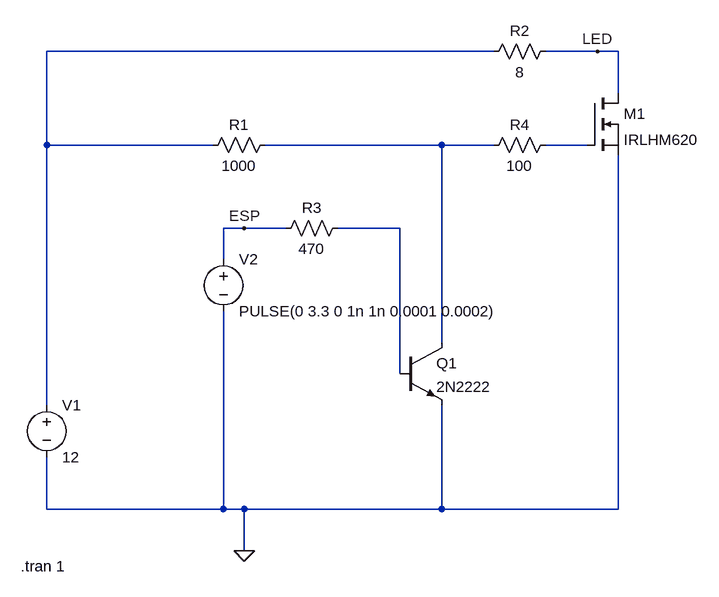
[diagram p0: schematic Draft1.asc]
Draft1.asc, the LTspice schematic file:
Version 4.1
SHEET 1 1384 680
WIRE 1056 -768 368 -768
WIRE 1216 -768 1136 -768
WIRE 1248 -768 1216 -768
WIRE 1248 -704 1248 -768
WIRE 368 -624 368 -768
WIRE 624 -624 368 -624
WIRE 976 -624 704 -624
WIRE 1056 -624 976 -624
WIRE 1200 -624 1136 -624
WIRE 672 -496 640 -496
WIRE 736 -496 672 -496
WIRE 912 -496 816 -496
WIRE 640 -448 640 -496
WIRE 976 -320 976 -624
WIRE 912 -272 912 -496
WIRE 368 -224 368 -624
WIRE 368 -64 368 -144
WIRE 640 -64 640 -368
WIRE 640 -64 368 -64
WIRE 672 -64 640 -64
WIRE 976 -64 976 -224
WIRE 976 -64 672 -64
WIRE 1248 -64 1248 -608
WIRE 1248 -64 976 -64
WIRE 672 0 672 -64
FLAG 672 0 0
FLAG 1216 -768 LED
FLAG 672 -496 ESP
SYMBOL npn 912 -320 R0
SYMATTR InstName Q1
SYMATTR Value 2N2222
SYMBOL nmos 1200 -704 R0
SYMATTR InstName M1
SYMATTR Value IRLHM620
SYMBOL voltage 368 -240 R0
WINDOW 123 0 0 Left 0
WINDOW 39 0 0 Left 0
SYMATTR InstName V1
SYMATTR Value 12
SYMBOL res 720 -640 R90
WINDOW 0 0 56 VBottom 2
WINDOW 3 32 56 VTop 2
SYMATTR InstName R1
SYMATTR Value 1000
SYMATTR SpiceLine pwr=0.25
SYMBOL res 1040 -752 R270
WINDOW 0 32 56 VTop 2
WINDOW 3 0 56 VBottom 2
SYMATTR InstName R2
SYMATTR Value 8
SYMATTR SpiceLine pwr=0.25
SYMBOL voltage 640 -464 R0
WINDOW 123 0 0 Left 0
WINDOW 39 24 44 Left 2
SYMATTR InstName V2
SYMATTR Value PULSE(0 3.3 0 1n 1n 0.0001 0.0002)
SYMBOL res 720 -480 R270
WINDOW 0 32 56 VTop 2
WINDOW 3 0 56 VBottom 2
SYMATTR InstName R3
SYMATTR Value 470
SYMBOL res 1152 -640 R90
WINDOW 0 0 56 VBottom 2
WINDOW 3 32 56 VTop 2
SYMATTR InstName R4
SYMATTR Value 100
TEXT 328 24 Left 2 !.tran 1

The netlist it stands for:
* Draft1.asc
Q1 N002 N004 0 0 2N2222
M1 LED N003 0 0 IRLHM620
V1 N001 0 12
R1 N002 N001 1000 pwr=0.25
R2 N001 LED 8 pwr=0.25
V2 ESP 0 PULSE(0 3.3 0 1n 1n 0.0001 0.0002)
R3 ESP N004 470
R4 N003 N002 100
.model NPN NPN
.model PNP PNP
.lib standard.bjt
.model NMOS NMOS
.model PMOS PMOS
.lib standard.mos
.tran 1
.backanno
.end